# Altium schematic sheet Main.SchDoc
size A4
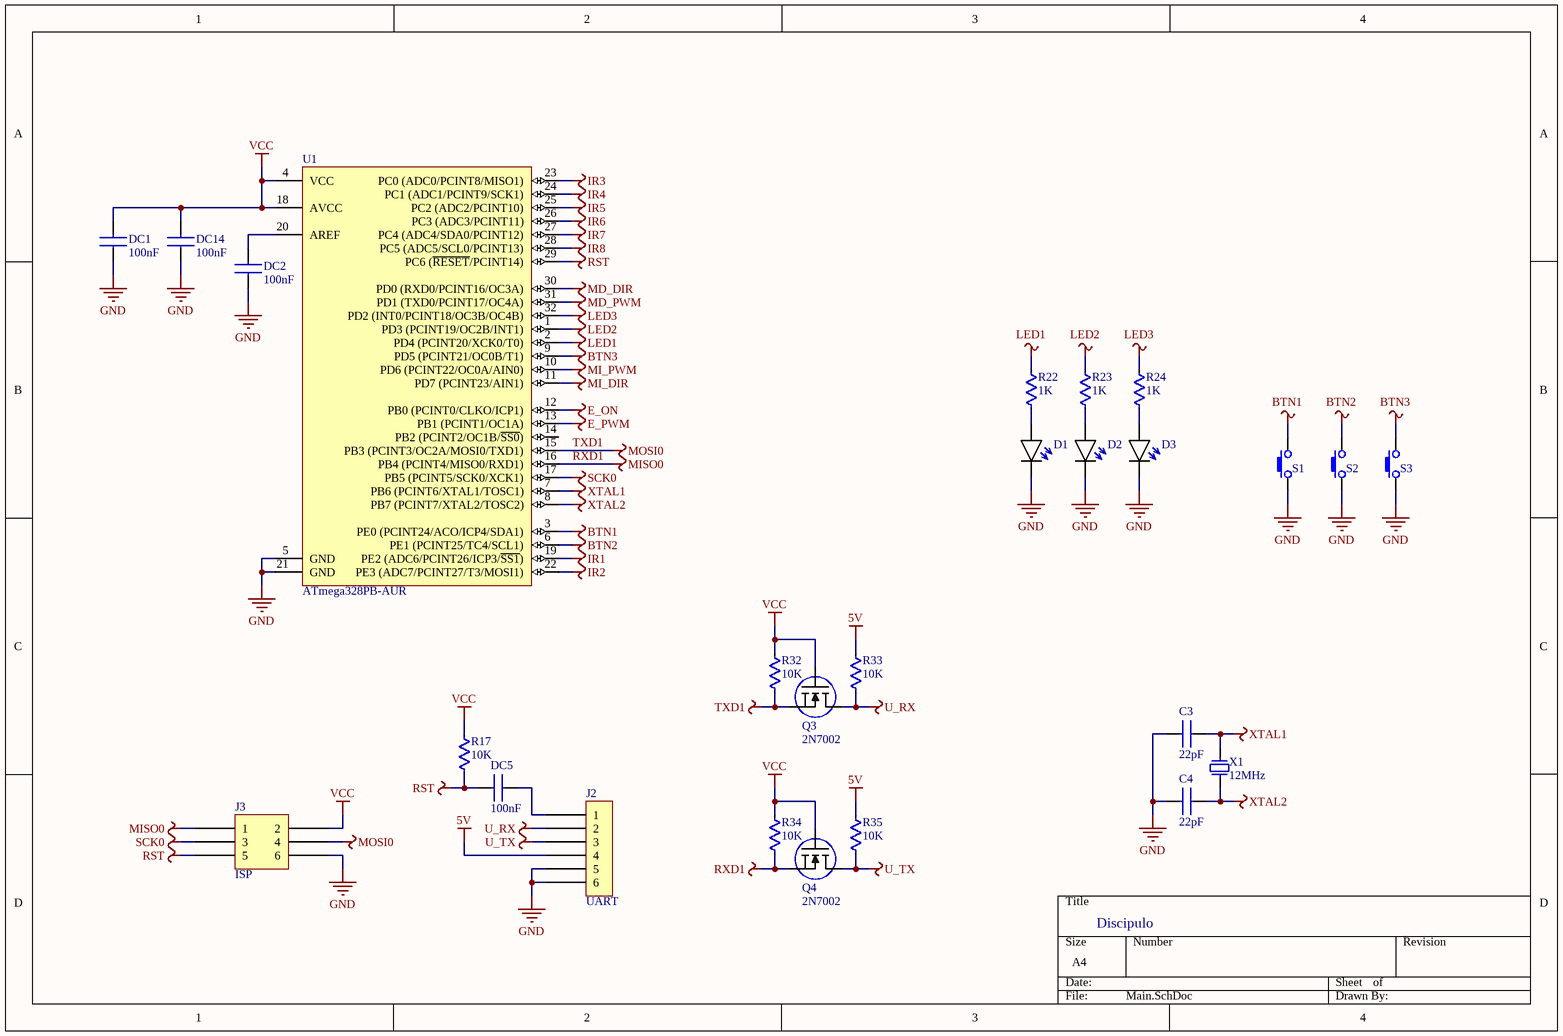
[diagram p0: Main.SchDoc]

## Parts
C3  value 22pF  [C1206]  (hidden comment: CAP-CER)
C4  value 22pF  [C1206]  (hidden comment: CAP-CER)
D1  LED  [LED-3MM-YELLOW]  (value not drawn)
D2  LED  [LED-3MM-YELLOW]  (value not drawn)
D3  LED  [LED-3MM-YELLOW]  (value not drawn)
DC1  value 100nF  [C1206]  (hidden comment: CAP-CER)
DC2  value 100nF  [C1206]  (hidden comment: CAP-CER)
DC5  value 100nF  [C1206]  (hidden comment: CAP-CER)
DC14  value 100nF  [C1206]  (hidden comment: CAP-CER)
J2  UART  [Header 1x6]
J3  ISP  [HEADER 2x3]
Q3  2N7002  [SOT-23]
Q4  2N7002  [SOT-23]
R17  value 10K  [R1206]  (hidden comment: RES)
R22  value 1K  [R1206]  (hidden comment: RES)
R23  value 1K  [R1206]  (hidden comment: RES)
R24  value 1K  [R1206]  (hidden comment: RES)
R32  value 10K  [R1206]  (hidden comment: RES)
R33  value 10K  [R1206]  (hidden comment: RES)
R34  value 10K  [R1206]  (hidden comment: RES)
R35  value 10K  [R1206]  (hidden comment: RES)
S1  BUTTON  [TACT_SWITCH-SMALL-4PIN]  (value not drawn)
S2  BUTTON  [TACT_SWITCH-SMALL-4PIN]  (value not drawn)
S3  BUTTON  [TACT_SWITCH-SMALL-4PIN]  (value not drawn)
U1  ATmega328PB-AUR  [32A_M]
X1  FREQUENCY: 12MHz  [HC-49/S]  (hidden comment: XTAL)

## Nets
5V: J2.4 R33.2 R35.2
BTN1: S1.2 U1.3(PE0_(PCINT24/ACO/ICP4/SDA1))
BTN2: S2.2 U1.6(PE1_(PCINT25/TC4/SCL1))
BTN3: S3.2 U1.9(PD5_(PCINT21/OC0B/T1))
E_ON: U1.12(PB0_(PCINT0/CLKO/ICP1))
E_PWM: U1.13(PB1_(PCINT1/OC1A))
GND: C3.1 C4.1 D1.K D2.K D3.K DC1.2 DC2.2 DC14.1 J2.5 J2.6 J3.6 S1.1 S2.1 S3.1 U1.5(GND) U1.21(GND)
IR1: U1.19(PE2_(ADC6/PCINT26/ICP3/~{SS1}))
IR2: U1.22(PE3_(ADC7/PCINT27/T3/MOSI1))
IR3: U1.23(PC0_(ADC0/PCINT8/MISO1))
IR4: U1.24(PC1_(ADC1/PCINT9/SCK1))
IR5: U1.25(PC2_(ADC2/PCINT10))
IR6: U1.26(PC3_(ADC3/PCINT11))
IR7: U1.27(PC4_(ADC4/SDA0/PCINT12))
IR8: U1.28(PC5_(ADC5/SCL0/PCINT13))
LED1: R22.2 U1.2(PD4_(PCINT20/XCK0/T0))
LED2: R23.2 U1.1(PD3_(PCINT19/OC2B/INT1))
LED3: R24.2 U1.32(PD2_(INT0/PCINT18/OC3B/OC4B))
MD_DIR: U1.30(PD0_(RXD0/PCINT16/OC3A))
MD_PWM: U1.31(PD1_(TXD0/PCINT17/OC4A))
MI_DIR: U1.11(PD7_(PCINT23/AIN1))
MI_PWM: U1.10(PD6_(PCINT22/OC0A/AIN0))
RST: DC5.1 J3.5 R17.1 U1.29(PC6_(~{RESET}/PCINT14))
RXD1: J3.1 Q4.S R34.1 U1.16(PB4_(PCINT4/MISO0/RXD1))  [also labelled MISO0]
SCK0: J3.3 U1.17(PB5_(PCINT5/SCK0/XCK1))
TXD1: J3.4 Q3.S R32.1 U1.15(PB3_(PCINT3/OC2A/MOSI0/TXD1))  [also labelled MOSI0]
U_RX: J2.2 Q3.D R33.1
U_TX: J2.3 Q4.D R35.1
VCC: DC1.1 DC14.2 J3.2 Q3.G Q4.G R17.2 R32.2 R34.2 U1.4(VCC) U1.18(AVCC)
XTAL1: C3.2 U1.7(PB6_(PCINT6/XTAL1/TOSC1)) X1.2
XTAL2: C4.2 U1.8(PB7_(PCINT7/XTAL2/TOSC2)) X1.1
NetD1_A: D1.A R22.1
NetD2_A: D2.A R23.1
NetD3_A: D3.A R24.1
NetDC2_1: DC2.1 U1.20(AREF)
NetDC5_2: DC5.2 J2.1

Not connected (* = marked no-connect by the designer): U1 14(PB2_(PCINT2/OC1B/~{SS0}))

## Notes on the sheet
- Discipulo

## Library data of the parts
J2 = Header 1x6
J3 = Header 2x3
Q3 Q4 = N-MOSFET: pin to pad: D>C G>B S>E
U1 = ATmega328PB-AUR: 8-bit AVR Microcontroller, 32KB Flash, 1KB EEPROM, 2KB SRAM, 32-pin TQFP, Industrial Grade (-40°C to 85°C), Reel; DatasheetVersion: revD, May-2011; PackageVersion: revC, Oct-2010; PackageReference: 32A; PackageDescription: 32-Lead, 7x7x1.0 mm Body, 0.8mm Lead Pitch, Thin Profile Plastic Quad Flat Package (TQFP); Code_JEDEC: MS-026-ABA; ComponentLink1Description: Manufacturer URL; ComponentLink1URL: http://www.atmel.com/; ComponentLink2Description: ATmega48A/48PA/88A/88PA/168A/168PA/328/328P Datasheet; ComponentLink2URL: http://www.atmel.com/dyn/resources/prod_documents/doc8271.pdf; ComponentLink3Description: ATmega48A/48PA/88A/88PA/168A/168PA/328/328P Summary; ComponentLink3URL: http://www.atmel.com/dyn/resources/prod_documents/8271S.pdf